# Altium schematic sheet course.SchDoc
size A4; SheetNumber: 1; SheetTotal: 1
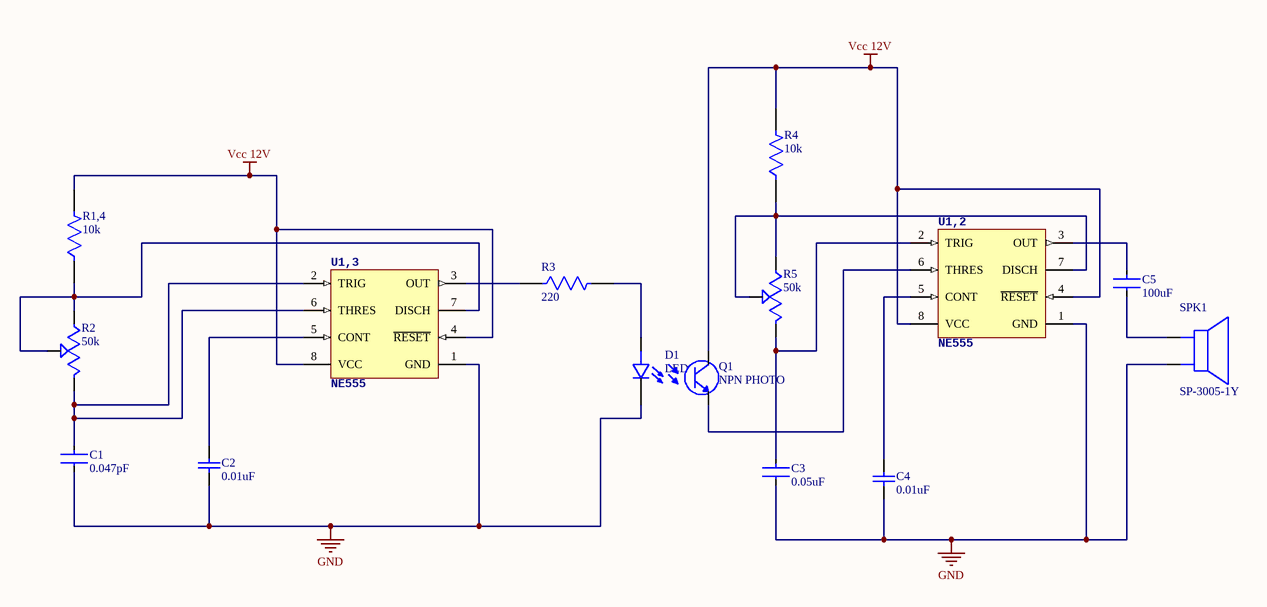
[diagram p0: course.SchDoc]

## Parts
C1  0.047pF  [C0603C473M5RAC7867]
C2  0.01uF  [CAPC1206(3216)100_L]
C3  0.05uF  [FP-C0805C-DN-IPC_A]
C4  0.01uF  [CAPC1206(3216)100_L]
C5  100uF  [FP-EMK325A-M-IPC_A]
D1  LED  [DIO_VSMY2853G]
Q1  NPN PHOTO  [XDCR_VEMT2523X01]
R1,4  10k  [FP-RMCF0805-IPC_A]
R2  50k  [TRIM_PVG5A503C03R00]
R3  220  [FP-MCU0805-IPC_A]
R4  10k  [FP-RMCF0805-IPC_A]
R5  50k  [TRIM_PVG5A503C03R00]
SPK1  SP-3005-1Y
U1,2  NE555  [D0008A_L]
U1,3  NE555  [D0008A_L]

## Nets
GND: C1.2 C2.1 C3.2 C4.1 D1.1 SPK1.2 U1,2.1(GND) U1,3.1(GND)
Vcc 12V: Q1.1 R1,4.2 R4.2 U1,2.4(~{RESET}) U1,2.8(VCC) U1,3.4(~{RESET}) U1,3.8(VCC)
NetC1_1: C1.1 R2.3 U1,3.2(TRIG) U1,3.6(THRES)
NetC2_2: C2.2 U1,3.5(CONT)
NetC3_1: C3.1 R5.3 U1,2.2(TRIG)
NetC4_2: C4.2 U1,2.5(CONT)
NetC5_1: C5.1 SPK1.1
NetC5_2: C5.2 U1,2.3(OUT)
NetD1_2: D1.2 R3.2
NetQ1_2: Q1.2 U1,2.6(THRES)
NetR1,4_1: R1,4.1 R2.1 R2.2 U1,3.7(DISCH)
NetR3_1: R3.1 U1,3.3(OUT)
NetR4_1: R4.1 R5.1 R5.2 U1,2.7(DISCH)

## Library data of the parts
C1 = C0603C473M5RAC7867: CAP CER 0.047UF 50V X7R 0603; Manufacturer: KEMET; Tolerance: 0.2; Automotive Grade: Grade 1; Value: 47,000 pF; Temperature Coefficient: 30ppm/°C; Material: Ceramic; Temperature: -55°C to +125°C; Category: Ceramic Capacitors; Package: C0603C-CF; Device Class L3: Ceramic Capacitors; Lead Free: Yes; Height: 0.87mm; Temperature Range High: +125°C; Automotive: Yes; ComponentLink2URL: https://api.kemet.com/component-edge/download/datasheet/C0603C100J5GACAUTO.pdf; Temperature Range Low: -55°C; ComponentLink2Description: Datasheet; Octopart: https://octopart.com/c0603c473m5rac7867-kemet-1577561; Manufacturer Part Number: C0603C473M5RAC7867; Voltage Rating: 50 V; RoHS: TRUE; Temperature Characteristic: X7R; Device Class L2: Capacitors; Device Class L1: Passive Components; Capacitance: 47,000 pF; Digikey Description: CAP CER 0.047UF 50V X7R 0603; Supplier 1: Digi-Key; Supplier Part Number 1: 399-14294-1-ND
C2 C4 = C1206C103K5RAC7025: Cap Ceramic 0.01uF 50V X7R 10% SMD 1206 125°C Plastic T/R; Case-EIA: 1206; Case-Metric: 3216; Value: 10nF; Tolerance: Â±10%; Technology: SMT; Max Thickness: 1 mm; Rated Voltage: 50 V; Supplier 1: Digi-Key; Supplier Part Number 1: 399-17657-1-ND; Category: Ceramic Capacitors
C3 = C0805C563K5RACTU: CAP CER 0.056UF 50V 10% X7R 0805; Manufacturer: KEMET; Temperature Coefficient: 30ppm/°C; Tolerance: 0.1; Value: 56,000 pF; Material: Ceramic; Ipc Land Pattern Name: CAPC200125X78; RoHS: TRUE; Automotive: No; Category: Ceramic Capacitors; Octopart: https://octopart.com/c0805c563k5ractu-kemet-10470779; Temperature Range Low: -55°C; Height: 0.88mm; Device Class L1: Passive Components; Digikey Description: CAP CER 0.056UF 50V 10% X7R 0805; Manufacturer Part Number: C0805C563K5RACTU; Temperature: -55°C to +125°C; Temperature Characteristic: X7R; Package: C0805C-DN; Device Class L3: Ceramic Capacitors; Mouser Description: Cap Ceramic 0.056uF 50V X7R 10% SMD 0805 125°C Paper T/R; ComponentLink2Description: Datasheet; Capacitance: 56,000 pF; Device Class L2: Capacitors; Temperature Range High: +125°C; ComponentLink2URL: https://content.kemet.com/datasheets/KEM_C1003_C0G_SMD.pdf; Voltage Rating: 50 V; Lead Free: Yes; Supplier 1: Digi-Key; Supplier Part Number 1: 399-8107-1-ND
C5 = EMK325ABJ107MM-T: CAP CER 100UF 16V X5R 1210; Manufacturer: Taiyo Yuden; Material: Ceramic; Temperature Coefficient: 15%; Tolerance: 20%; Ipc Land Pattern Name: CAPC320250X250; Package: EMK325A-M; Device Class L1: Passive Components; Height: 2.8mm; Device Class L2: Capacitors; Temperature Range Low: -55°C; RoHS: TRUE; Temperature Characteristic: X5R; Mouser Description: 1210 100 uF 16 V ±20% Tolerance X5R SMT Multilayer Ceramic Capacitor; ComponentLink2Description: Datasheet; Temperature: -55°C to +85°C; Device Class L3: Ceramic Capacitors; Capacitance: 100uF; Lead Free: Yes; Category: Ceramic Capacitors; Octopart: https://octopart.com/emk325abj107mm-t-taiyo+yuden-20815747; Temperature Range High: +85°C; Automotive: No; Manufacturer Part Number: EMK325ABJ107MM-T; Value: 100uF; Digikey Description: CAP CER 100UF 16V X5R 1210; Voltage Rating: 16V; ComponentLink2URL: https://www.yuden.co.jp/productdata/catalog/mlcc01_e.pdf; Supplier 1: Digi-Key; Supplier Part Number 1: 587-3152-1-ND
D1 = VSMY2853G: 850 nm 100 mA Â±28Â° Surface Mount High Speed Infrared Emitting Diode; Package: None; Price: None; Value: *; MP: VSMY2853G; Availability: Unavailable; Supplier 1: Digi-Key; Supplier Part Number 1: VSMY2853GCT-ND; Category: LED Emitters - Infrared, UV, Visible
Q1 = VEMT2523X01: PHOTOTRANSISTOR 470 TO 1090 NM; Package: None; Price: None; Value: *; MP: VEMT2523X01; Availability: Unavailable; Supplier 1: Digi-Key; Supplier Part Number 1: VEMT2523X01CT-ND; Category: Optical Sensors - Phototransistors
R1,4 R4 = RMCF0805JT10K0: 10kΩ ±5% 0.125W 0805 Thick Film Chip Resistor AEC-Q200 compliant; Resistance: 10kR; Max Power Dissipation: 125mW; Temperature Coefficient: 100ppm/°C; Construction: Rectangular; RoHS Compliant: Yes; Resistor Type: Thick Film; Series: RMCF; Features: Automotive AEC-Q200; Case Code (Imperial): 0805; Mount: Surface Mount; Min Operating Temperature: -55°C; Military Standard: Not; Tolerance: 5%; Size Code: 0805; Contact Plating: Tin; Length: 2mm; Depth: 1.25mm; Case Code (Metric): 2012; Packaging: Tape and Reel; Radiation Hardening: No; Height: 0.026inch; Case/Package: 0805; Width: 0.049inch; Lead Free: Lead Free; Max Operating Temperature: 155°C; Number of Terminations: 2; Power Rating: 125mW; Supplier 1: Digi-Key; Category: Chip Resistor - Surface Mount; Supplier Part Number 1: RMCF0805JT10K0CT-ND
R2 R5 = PVG5A503C03R00: 50 kOhms 0.25W, 1/4W J Lead Surface Mount Trimmer Potentiometer Cermet 11 Turn Top Adjustment; MF: Bourns; SnapEDA_Link: https://www.snapeda.com/parts/PVG5A503C03R00/Bourns/view-part/1439221/?ref=snap; Value: *; MP: PVG5A503C03R00; Package: SMD-3 Bourns; Digi-Key_Part_Number: 490-2673-1-ND; Supplier 1: Digi-Key; Supplier Part Number 1: 490-2673-1-ND; Category: Potentiometers, Variable Resistors
R3 = MCU08050C2200FP500: Res Thin Film 0805 220 Ohm 1% 1/8W 50ppm/C Molded SMD SMD Paper T/R; Resistance: 220R; Temperature Coefficient: 50ppm/°C; Max Power Dissipation: 200mW; Contact Plating: Tin; Packaging: Tape and Reel; Height: 0.022inch; Radiation Hardening: No; Package Quantity: 5000; Length: 0.079inch; Lead Free: Lead Free; Depth: 1.25mm; Composition: Thin Film; Width: 0.049inch; Min Operating Temperature: -55°C; Case/Package: 0805; Tolerance: 1%; Military Standard: Not; Max Operating Temperature: 125°C; Number of Terminations: 2; Supplier 1: Digi-Key; Supplier Part Number 1: 749-1727-1-ND; Category: Chip Resistor - Surface Mount
SPK1 = SP-3005-1Y: SPEAKER, 92DB SENSITIVITY, 30MM; Manufacturer: Soberton; Supplier 1: Digi-Key; Manufacturer Part Number: SP-3005-1Y; RoHS: No; Stock 1: 560; Pricing 1: 1=1,66000, 10=1,38000, 25=1,27600, 40=1,19975, 100=1,12650, 500=0,96694, 1000=0,94430 (USD); Supplier Part Number 1: 433-1258-ND; Category: Speakers
U1,2 U1,3 = NE555D: Precision Timer, 4.5 to 16 V, 0 to 70 degC, 8-Pin SOIC (D), Green (RoHS & no Sb/Br), Tube; Manufacturer: Texas Instruments; Base Number: 555; No. of Timers: 1; Supply Voltage Min: 4.5V; Operating Frequency Max: 0.5MHz; Supply Voltage Range: 4.5Vto16V; No. of Pins: 8; Supply Voltage Max: 16V; IC Temperature Range: Commercial; SVHC: NoSVHC(19-Dec-2012); Operating Mode: Astable,Monostable; Frequency: 500kHz; Package Description: 8-Pin Small Outline Integrated Circuit, Body 4.9 x 3.9 mm, Pitch 1.27 mm; Datasheet URL: http://www.ti.com/general/docs/lit/getliterature.tsp?genericPartNumber=NE555&fileType=pdf; Mounting Technology: SurfaceMount; Operating Temperature Range: 0°Cto+70°C; Operating Temperature Min: 0°C; Package URL: http://www.ti.com/lit/ml/msoi002j/msoi002j.pdf; Datasheet Version: Rev. I, 09/2014; Manufacturer URL: http://www.ti.com/; Digital IC Case Style: SOIC; PartNumber: NE555; Clock External Input: No; Logic Function Number: 555; IC Generic Number: 555; No. of Channels: 1; Operating Temperature Max: 70°C; Package / Case: SOIC; Package Reference: D8; Device Marking: NE555D; Supplier 1: Digi-Key; Supplier Part Number 1: 296-16792-ND; Category: Clock/Timing - Programmable Timers and Oscillators